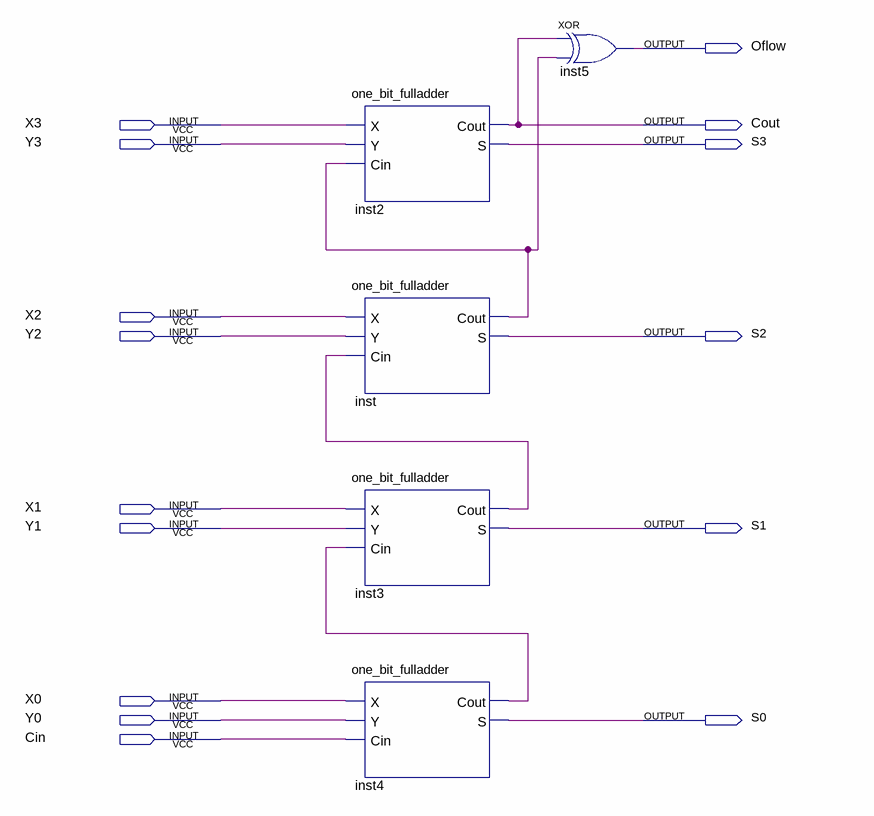
[diagram p0: schematic sheet]
// Quartus schematic fourbit_adder.bdf as structural Verilog: 5 symbols, 15 pins
module fourbit_adder (
  input  X3,
  input  Y3,
  input  X2,
  input  Y2,
  input  X1,
  input  Y1,
  input  X0,
  input  Y0,
  input  Cin,
  output Oflow,
  output Cout,
  output S3,
  output S2,
  output S1,
  output S0
);

  wire inst3_cout, inst4_cout, inst_cout;

  one_bit_fulladder inst2 (.X(X3), .Y(Y3), .Cin(inst_cout), .Cout(Cout), .S(S3));
  one_bit_fulladder inst (.X(X2), .Y(Y2), .Cin(inst3_cout), .Cout(inst_cout), .S(S2));
  one_bit_fulladder inst3 (.X(X1), .Y(Y1), .Cin(inst4_cout), .Cout(inst3_cout), .S(S1));
  one_bit_fulladder inst4 (.X(X0), .Y(Y0), .Cin(Cin), .Cout(inst4_cout), .S(S0));
  xor inst5 (Oflow, Cout, inst_cout);
endmodule
